# EAGLE board Battery Charger (EAGLE 9.6.2)
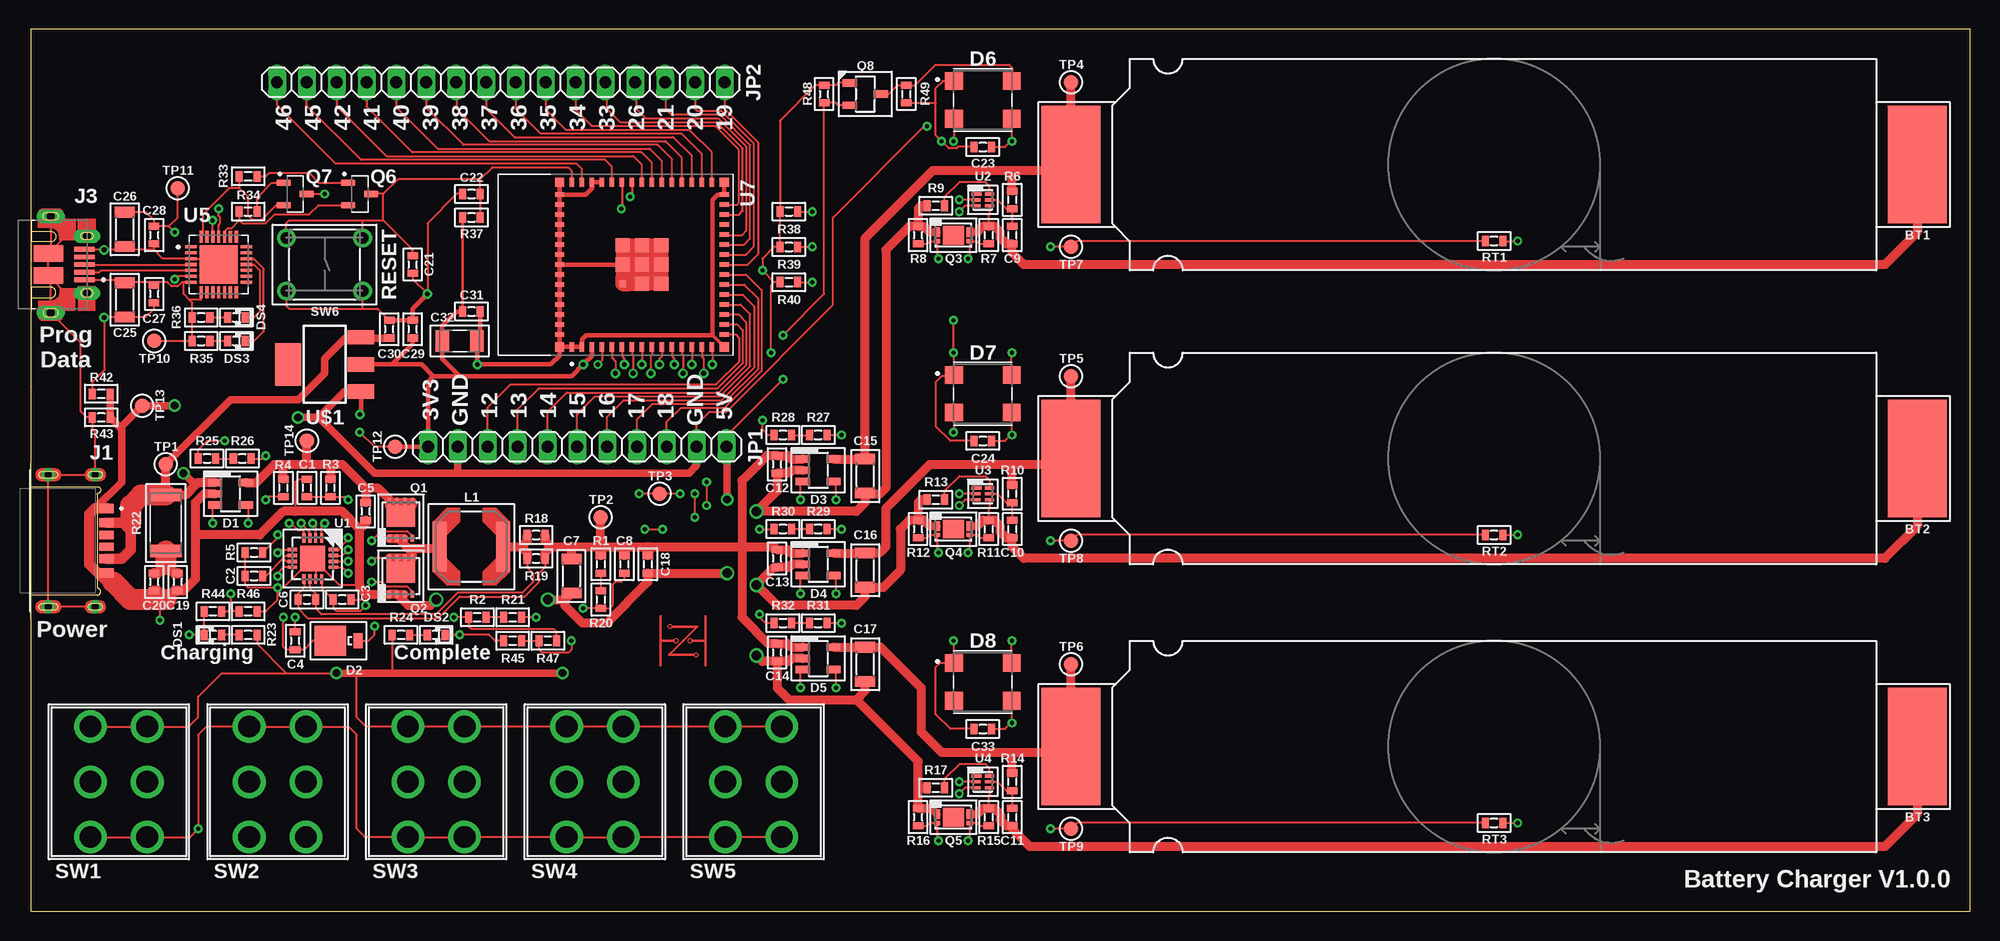
[diagram p5: board, top side]
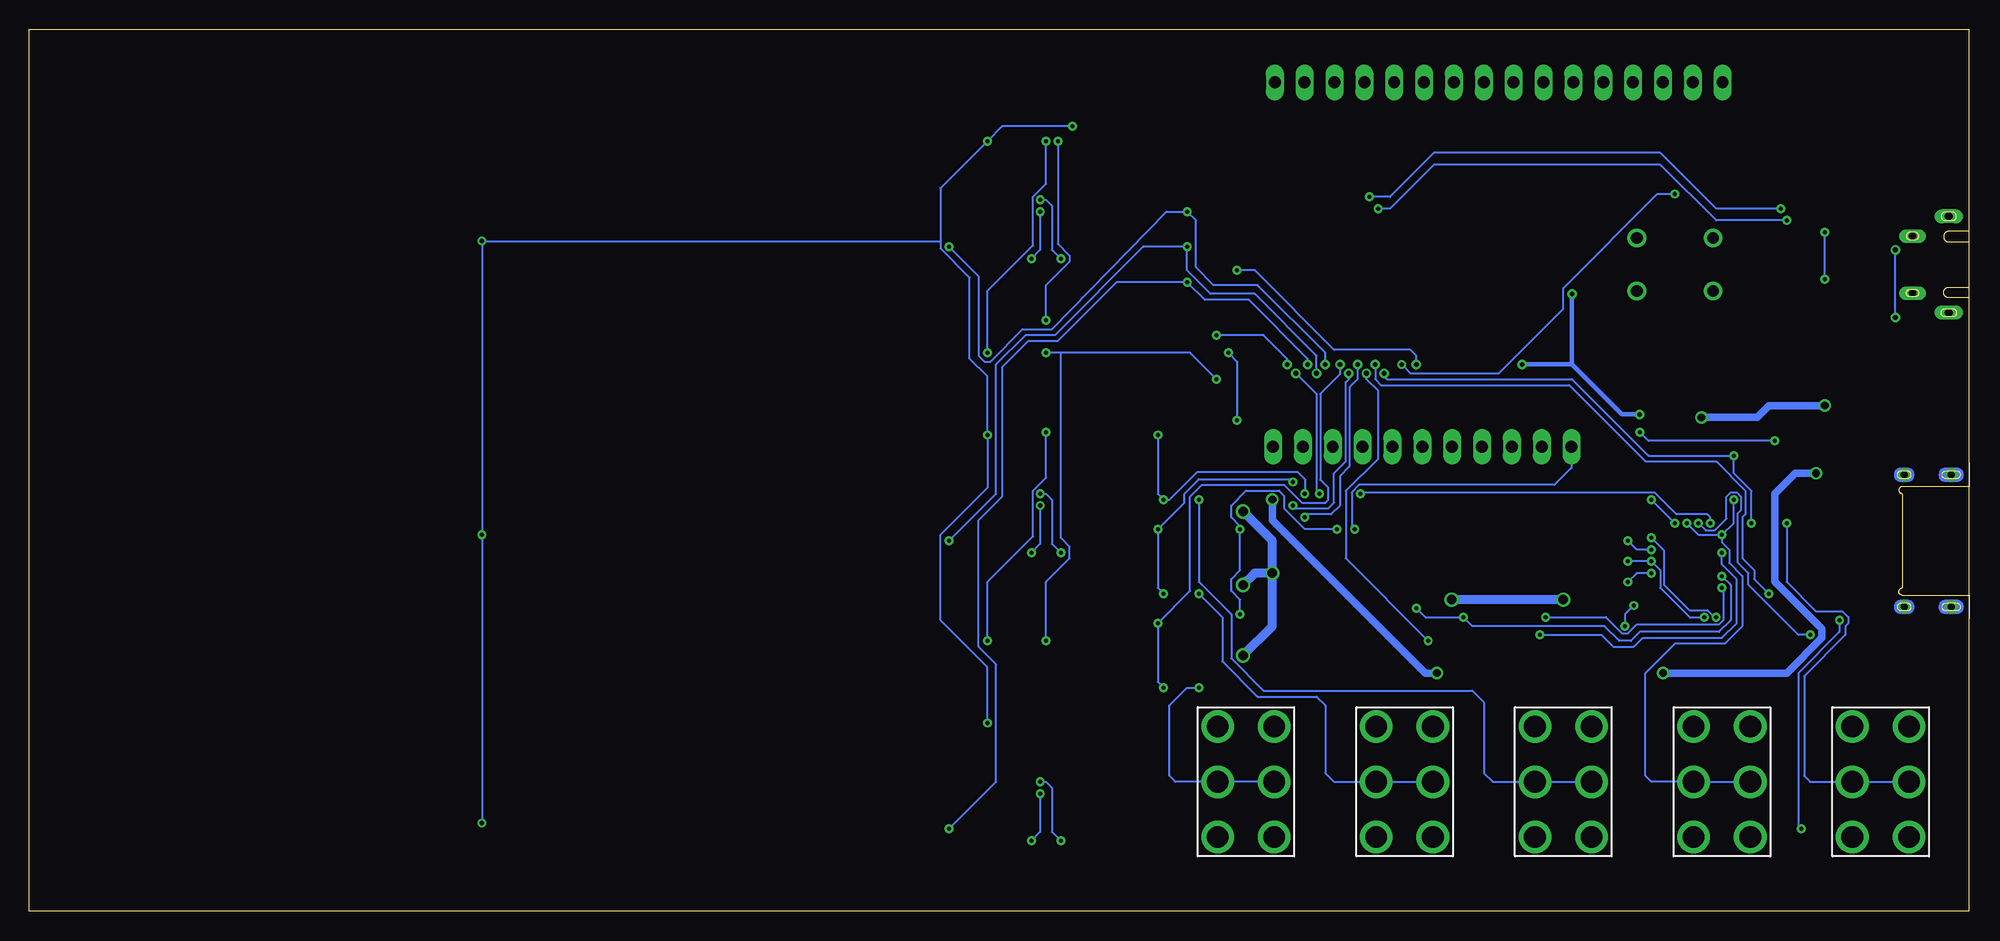
[diagram p6: board, bottom side, seen from below]

Size 165 x 75 mm. Coordinates in mm from the lower left corner, seen from the top.
Outline: 0,0 165,0 165,75 0,75 0,0
Copper layers (1*16): Top 0.035mm / dielectric 1.5mm / Bottom 0.035mm
Design rules "default": minimum track width 6mil, minimum drill 0.35mm, track to track 6mil, track to pad 6mil, pad to pad 6mil, via to via 6mil, smd to smd 6mil, copper to edge 40mil, drill to drill 6mil, minimum pad ring 10mil, minimum via ring 8mil, stop-mask expansion 4mil, vias tented up to drill 0mil, thermal gap 10mil

## Footprints (pad centres in the part's own frame; a part is rotated, then mirrored left to right if it is on the bottom)
18650-SOLDERED = smd 5 x 10: A -36,0; C 36,0
1608 = smd 0.6 x 0.9: 1 -0.75,0; 2 0.75,0
3216 = smd 0.9 x 1.7: 1 -1.45,0; 2 1.45,0
CAPC3216X110N = smd 1.16 x 1.82: 1 -1.475,0; 2 1.475,0
SOT23-5 = smd 1.22 x 0.62: 1 -1.31,0.95; 2 -1.31,0; 3 -1.31,-0.95; 4 1.31,-0.95; 5 1.31,0.95
POWERMITE = smd 0.76 x 1.27: A 2.349,0 | smd 2.67 x 2.54: C 0,0
LED_SK6812 = smd 1.5 x 1.5: 1 -2.45,1.6; 2 -2.45,-1.6; 3 2.45,-1.6; 4 2.45,1.6
1608-POL = smd 0.6 x 0.9: A 0.75,0; C -0.75,0
GCT_USB4515-GF-A_REVA = smd 0.7 x 1.2: A5 -0.5,4.95; B5 0.5,4.95 | smd 0.76 x 1.2: A9 1.52,4.95; B9 -1.52,4.95 | smd 0.8 x 1.2: A12 2.75,4.95; B12 -2.75,4.95 | drill 0.6 pad 1.1: S1 -5.62,0; S2 5.62,0; S3 -5.62,4; S4 5.62,4
AMPHENOL_10103592-0001LF = smd 0.4 x 1.75: 1 1.3,2.875; 2 0.65,2.875; 3 0,2.875; 4 -0.65,2.875; 5 -1.3,2.875 | drill 0.7 pad 0.9 long: S1 -4.1,0; S3 4.1,0 | drill 0.65 pad 0.73 long: S2 -2.425,3.08; S4 2.425,3.08 | smd 1.375 x 2.5: S5 -0.938,-0.2; S6 0.938,-0.2
1X11 = drill 1.016 long: 1 -12.7,0; 2 -10.16,0; 3 -7.62,0; 4 -5.08,0; 5 -2.54,0; 6 0,0; 7 2.54,0; 8 5.08,0; 9 7.62,0; 10 10.16,0; 11 12.7,0
1X16 = drill 1.016 long: 1 -19.05,0; 2 -16.51,0; 3 -13.97,0; 4 -11.43,0; 5 -8.89,0; 6 -6.35,0; 7 -3.81,0; 8 -1.27,0; 9 1.27,0; 10 3.81,0; 11 6.35,0; 12 8.89,0; 13 11.43,0; 14 13.97,0; 15 16.51,0; 16 19.05,0
6060 = smd 1.2 x 4.25: 1 -2.7,0; 2 2.7,0
SON-3333 = smd 0.6 x 0.3: 1 -1.55,0.975; 2 -1.55,0.325; 3 -1.55,-0.325; 4 -1.55,-0.975; 5 1.55,-0.975; 6 1.55,-0.325; 7 1.55,0.325; 8 1.55,0.975 | smd 1.775 x 2.45: PAD 0.325,0
UDFN-6-B = smd 0.53 x 0.84: 1 -1.385,0.255; 6 1.385,0.255 | smd 0.53 x 0.35: 3 -1.385,-0.5; 4 1.385,-0.5 | smd 1.8 x 1.6: PAD 0,0
SOT95P230X110-3N = smd 1.26 x 0.59: 1 -0.98,0.95; 2 -0.98,-0.95; 3 0.98,0
SOT23-3 = smd 1.22 x 0.62: 1 -1.31,0.95; 2 -1.31,-0.95; 3 1.31,0
RESC5025X65N = smd 1.07 x 2.67: 1 -2.38,0; 2 2.38,0
100DP1T1B1M2QE = drill 1.85: 1-A -2.41,4.7; 1-B 2.41,4.7; 2-A -2.41,-4.7; 2-B 2.41,-4.7; COM-A -2.41,0; COM-B 2.41,0
THT-6060 = drill 1 pad 1.6: 1 3.25,-2.25; 2 -3.25,-2.25; 3 3.25,2.25; 4 -3.25,2.25
SMD-C-1.25 = smd 1.25 x 1.25: 1 0,0
QFN-16-3535 = smd 0.8 x 0.28: 1 -1.75,0.75; 2 -1.75,0.25; 3 -1.75,-0.25; 4 -1.75,-0.75; 9 1.75,-0.75; 10 1.75,-0.25; 11 1.75,0.25; 12 1.75,0.75 | smd 0.28 x 0.8: 5 -0.75,-1.75; 6 -0.25,-1.75; 7 0.25,-1.75; 8 0.75,-1.75; 13 0.75,1.75; 14 0.25,1.75; 15 -0.25,1.75; 16 -0.75,1.75 | smd 2.14 x 2.14: PAD 0,0
WSON-6 = smd 0.85 x 0.28: 1 -0.525,0.5 | smd 0.75 x 0.28: 2 -0.575,0; 3 -0.575,-0.5; 4 0.575,-0.5; 5 0.575,0; 6 0.575,0.5
QFN50P500X500X80-29N = smd 0.99 x 0.27: 1 -2.36,1.5; 2 -2.36,1; 3 -2.36,0.5; 4 -2.36,0; 5 -2.36,-0.5; 6 -2.36,-1; 7 -2.36,-1.5; 15 2.36,-1.5; 16 2.36,-1; 17 2.36,-0.5; 18 2.36,0; 19 2.36,0.5; 20 2.36,1; 21 2.36,1.5 | smd 0.27 x 0.99: 8 -1.5,-2.36; 9 -1,-2.36; 10 -0.5,-2.36; 11 0,-2.36; 12 0.5,-2.36; 13 1,-2.36; 14 1.5,-2.36; 22 1.5,2.36; 23 1,2.36; 24 0.5,2.36; 25 0,2.36; 26 -0.5,2.36; 27 -1,2.36; 28 -1.5,2.36 | smd 3.25 x 3.25: 29 0,0
XCVR_ESP32-S2-MINI-1 = smd 0.8 x 0.4: 1 -7,5.95; 2 -7,5.1; 3 -7,4.25; 4 -7,3.4; 5 -7,2.55; 6 -7,1.7; 7 -7,0.85; 8 -7,0; 9 -7,-0.85; 10 -7,-1.7; 11 -7,-2.55; 12 -7,-3.4; 13 -7,-4.25; 14 -7,-5.1; 15 -7,-5.95; 31 7,-5.95; 32 7,-5.1; 33 7,-4.25; 34 7,-3.4; 35 7,-2.55; 36 7,-1.7; 37 7,-0.85; 38 7,0; 39 7,0.85; 40 7,1.7; 41 7,2.55; 42 7,3.4; 43 7,4.25; 44 7,5.1; 45 7,5.95 | smd 0.4 x 0.8: 16 -5.95,-7; 17 -5.1,-7; 18 -4.25,-7; 19 -3.4,-7; 20 -2.55,-7; 21 -1.7,-7; 22 -0.85,-7; 23 0,-7; 24 0.85,-7; 25 1.7,-7; 26 2.55,-7; 27 3.4,-7; 28 4.25,-7; 29 5.1,-7; 30 5.95,-7; 46 5.95,7; 47 5.1,7; 48 4.25,7; 49 3.4,7; 50 2.55,7; 51 1.7,7; 52 0.85,7; 53 0,7; 54 -0.85,7; 55 -1.7,7; 56 -2.55,7; 57 -3.4,7; 58 -4.25,7; 59 -5.1,7; 60 -5.95,7 | smd 1.2 x 1.2: 61 0,0; 61_1 -1.65,0; 61_2 -1.65,-1.65; 61_3 0,-1.65; 61_4 1.65,-1.65; 61_5 1.65,0; 61_6 1.65,1.65; 61_7 0,1.65 | smd 0.6 x 0.6: 61_8 -1.65,1.65 | smd 0.8 x 0.8: 62 -7,7; 63 -7,-7; 64 7,-7; 65 7,7
SOT223 = smd 1.219 x 2.235: 1 -2.311,-3.099; 2 0,-3.099; 3 2.311,-3.099 | smd 3.6 x 2.2: TAB 0,3.099

## Placement (x,y rotation side)
BT1  Li-Ion  [18650-SOLDERED]  124.5,63.5 180 top
BT2  Li-Ion  [18650-SOLDERED]  124.5,38.5 180 top
BT3  Li-Ion  [18650-SOLDERED]  124.5,14 180 top
C1  1µF 10%  [1608]  23.5,36 90 top
C2  1µF 10%  [1608]  19,28.5 180 top
C3  1µF 10%  [1608]  26.5,26.5 0 top
C4  100nF 10%  [1608]  22.5,23 90 top
C5  10µF 10%  [1608]  28.5,34 270 top
C6  100nF 10%  [1608]  23.5,26.5 180 top
C7  4.7µF 10%  [3216]  46,28.5 270 top
C8  22pF 5%  [1608]  50.5,29.5 270 top
C9  100nF 10%  [1608]  83.5,57.5 270 top
C10  100nF 10%  [1608]  83.5,32.5 270 top
C11  100nF 10%  [1608]  83.5,8 270 top
C12  1µF 10%  [1608]  63.5,38 270 top
C13  1µF 10%  [1608]  63.5,30 270 top
C14  1µF 10%  [1608]  63.5,22 270 top
C15  4.7µF 10%  [3216]  71,37 270 top
C16  4.7µF 10%  [3216]  71,29 270 top
C17  4.7µF 10%  [3216]  71,21 270 top
C18  10µF 10%  [1608]  52.5,29.5 270 top
C19  1µF 10%  [1608]  12.5,28 270 top
C20  1µF 10%  [1608]  10.5,28 270 top
C21  100nF 10%  [1608]  32.5,55 90 top
C22  100nF 10%  [1608]  37.5,61 180 top
C23  100nF 10%  [1608]  81,65 0 top
C24  100nF 10%  [1608]  81,40 0 top
C25  4.7µF 10%  [3216]  8,52 270 top
C26  4.7µF 10%  [3216]  8,58 270 top
C27  100nF 10%  [1608]  10.5,52.5 270 top
C28  100nF 10%  [1608]  10.5,57.5 270 top
C29  10µF 10%  [1608]  32.5,49.5 90 top
C30  100nF 10%  [1608]  30.5,49.5 90 top
C31  100nF 10%  [1608]  37.5,51 0 top
C32  C1206C226K8RACTU  [CAPC3216X110N]  36.5,48.5 180 top
C33  100nF 10%  [1608]  81,15.5 0 top
D1  LTC4411  [SOT23-5]  17,35.5 0 top
D2  MBRM120LT  [POWERMITE]  25.5,23 0 top
D3  LTC4411  [SOT23-5]  67,37.5 0 top
D4  LTC4411  [SOT23-5]  67,29.5 0 top
D5  LTC4411  [SOT23-5]  67,21.5 0 top
D6  SK6812  [LED_SK6812]  81,69 0 top
D7  SK6812  [LED_SK6812]  81,44 0 top
D8  SK6812  [LED_SK6812]  81,19.5 0 top
DS1  Blue  [1608-POL]  15.5,23.5 0 top
DS2  Green  [1608-POL]  34.5,23.5 180 top
DS3  Green  [1608-POL]  17.5,48.5 180 top
DS4  Green  [1608-POL]  17.5,50.5 180 top
J1  USB4515-GF-A_REVA  [GCT_USB4515-GF-A_REVA]  1.5,31.5 270 top
J3  10103592-0001LF  [AMPHENOL_10103592-0001LF]  1.7,55 270 top
JP1  [1X11]  46.5,39.5 180 top
JP2  [1X16]  40,70.5 180 top
L1  10µH 20%  [6060]  37.5,31 0 top
LOGO1  SIGNATUREZACHARY  [SIGN-ZACHARY]  55.5,23 0 top
Q1  CSD16406Q3  [SON-3333]  31.5,33.25 90 top
Q2  CSD16406Q3  [SON-3333]  31.5,28.5 90 top
Q3  DMN2008LFU  [UDFN-6-B]  78.5,57.5 0 top
Q4  DMN2008LFU  [UDFN-6-B]  78.5,32.5 0 top
Q5  DMN2008LFU  [UDFN-6-B]  78.5,8 0 top
Q6  BC817  [SOT95P230X110-3N]  28,61 0 top
Q7  BC817  [SOT95P230X110-3N]  22.5,61 0 top
Q8  DMN53D0L  [SOT23-3]  71,69.5 0 top
R1  10kΩ 0.1%  [1608]  48.5,29.5 90 top
R2  10kΩ 0.1%  [1608]  38,25 0 top
R3  10Ω 5%  [1608]  25.5,36 90 top
R4  47kΩ 0.1%  [1608]  21.5,36 90 top
R5  20kΩ 0.5%  [1608]  19,30.5 0 top
R6  330Ω 1%  [1608]  83.5,60.5 90 top
R7  4.75MΩ 1%  [1608]  81.5,57.5 270 top
R8  4.75MΩ 1%  [1608]  75.5,57.5 270 top
R9  2.2kΩ 1%  [1608]  77,60 0 top
R10  330Ω 1%  [1608]  83.5,35.5 90 top
R11  4.75MΩ 1%  [1608]  81.5,32.5 270 top
R12  4.75MΩ 1%  [1608]  75.5,32.5 270 top
R13  2.2kΩ 1%  [1608]  77,35 0 top
R14  330Ω 1%  [1608]  83.5,11 90 top
R15  4.75MΩ 1%  [1608]  81.5,8 270 top
R16  4.75MΩ 1%  [1608]  75.5,8 270 top
R17  2.2kΩ 1%  [1608]  77,10.5 0 top
R18  50mΩ 1%  [1608]  43,32 0 top
R19  50mΩ 1%  [1608]  43,30 0 top
R20  0Ω <20mΩ  [1608]  48.5,26.5 90 top
R21  0Ω <20mΩ  [1608]  41,25 0 top
R22  CRGH2010J2R0  [RESC5025X65N]  11.5,33 90 top
R23  10kΩ 0.1%  [1608]  18.5,23.5 0 top
R24  10kΩ 0.1%  [1608]  31.5,23.5 180 top
R25  442kΩ 1%  [1608]  15,38.5 180 top
R26  33kΩ 1%  [1608]  18,38.5 180 top
R27  33kΩ 1%  [1608]  67,40.5 180 top
R28  442kΩ 1%  [1608]  64,40.5 180 top
R29  33kΩ 1%  [1608]  67,32.5 180 top
R30  442kΩ 1%  [1608]  64,32.5 180 top
R31  33kΩ 1%  [1608]  67,24.5 180 top
R32  442kΩ 1%  [1608]  64,24.5 180 top
R33  10kΩ 0.1%  [1608]  18.5,62.5 0 top
R34  10kΩ 0.1%  [1608]  18.5,59.5 0 top
R35  10kΩ 0.1%  [1608]  14.5,48.5 180 top
R36  10kΩ 0.1%  [1608]  14.5,50.5 180 top
R37  10kΩ 0.1%  [1608]  37.5,59 180 top
R38  10kΩ 0.1%  [1608]  64.5,59.5 180 top
R39  10kΩ 0.1%  [1608]  64.5,56.5 180 top
R40  10kΩ 0.1%  [1608]  64.5,53.5 180 top
R42  0Ω <20mΩ  [1608]  6,44 0 top
R43  0Ω <20mΩ  [1608]  6,42 0 top
R44  75kΩ 0.1%  [1608]  15.5,25.5 180 top
R45  75kΩ 0.1%  [1608]  41,23 180 top
R46  100kΩ 0.1%  [1608]  18.5,25.5 180 top
R47  100kΩ 0.1%  [1608]  44,23 180 top
R48  10kΩ 0.1%  [1608]  67.5,69.5 90 top
R49  10kΩ 0.1%  [1608]  74.5,69.5 270 top
RT1  10kΩ 5%  [1608]  124.5,57 180 top
RT2  10kΩ 5%  [1608]  124.5,32 180 top
RT3  10kΩ 5%  [1608]  124.5,7.5 180 top
SW1  [100DP1T1B1M2QE]  7.5,11 0 top
SW2  [100DP1T1B1M2QE]  21,11 0 top
SW3  [100DP1T1B1M2QE]  34.5,11 0 top
SW4  [100DP1T1B1M2QE]  48,11 0 top
SW5  [100DP1T1B1M2QE]  61.5,11 0 top
SW6  [Override]  [THT-6060]  25,55 0 top
TP1-5.0V  TEST_POINT-SMD-C-1.25  [SMD-C-1.25]  11.5,38 0 top
TP2-CHARGER  TEST_POINT-SMD-C-1.25  [SMD-C-1.25]  48.5,33.5 0 top
TP3-TS  TEST_POINT-SMD-C-1.25  [SMD-C-1.25]  53.5,35.5 0 top
TP4-BATT_A  TEST_POINT-SMD-C-1.25  [SMD-C-1.25]  88.5,70.5 0 top
TP5-BATT_B  TEST_POINT-SMD-C-1.25  [SMD-C-1.25]  88.5,45.5 0 top
TP6-BATT_C  TEST_POINT-SMD-C-1.25  [SMD-C-1.25]  88.5,21 0 top
TP7-TEMP_A  TEST_POINT-SMD-C-1.25  [SMD-C-1.25]  88.5,56.5 180 top
TP8-TEMP_B  TEST_POINT-SMD-C-1.25  [SMD-C-1.25]  88.5,31.5 180 top
TP9-TEMP_C  TEST_POINT-SMD-C-1.25  [SMD-C-1.25]  88.5,7 180 top
TP10-USB_5.0V  TEST_POINT-SMD-C-1.25  [SMD-C-1.25]  10.5,48.5 180 top
TP11-CP2102N_VDD  TEST_POINT-SMD-C-1.25  [SMD-C-1.25]  12.5,61.5 0 top
TP12-3.3V  TEST_POINT-SMD-C-1.25  [SMD-C-1.25]  31,39.5 90 top
TP13-GND  TEST_POINT-SMD-C-1.25  [SMD-C-1.25]  9.5,43 180 top
TP14-D1_OUT  TEST_POINT-SMD-C-1.25  [SMD-C-1.25]  23.5,40 0 top
U1  BQ24650  [QFN-16-3535]  24,30 270 top
U2  BQ29700  [WSON-6]  81,60.5 0 top
U3  BQ29700  [WSON-6]  81,35.5 0 top
U4  BQ29700  [WSON-6]  81,11 0 top
U5  CP2102N-A02-GQFN28  [QFN50P500X500X80-29N]  16,55 0 top
U7  ESP32-S2-MINI-1  [XCVR_ESP32-S2-MINI-1]  52,55 90 top
U$1  LD1117AS33  [SOT223]  25,46.5 90 top

## Tracks (layer width: path | path; a pad name or v marks a point on that pad's centre or on a via)
3.3V  (via drill 0.35, 0.4)
  Top 0.17: R40.2 63.25,53.5 | 63.25,53.5 v62.25,54.5 62.25,55.5 63.25,56.5 R39.2 R38.2 63.75,67.25 66.75,70.25 R48.2 68.5,70.25 68.7,70.45 Q8.1 | v63,47.5 63,53.25 63.25,53.5 | R28.2 62.75,40.5 62.25,41 v62.25,41.75 | v52.25,32.5 v53.75,32.5 | v62,32.5 R30.2 | R32.2 62.5,24.5 62,25 v62,25.25 | TP12-3.3V.1 29.25,39.5 v28,40.75 | R25.2 14.25,39.25 15,40 v16.5,40
  Top 0.193: C31.1 R37.2
  Top 0.391: 36.5,45.5 46,45.5 v47,46.5 47.75,47.25 U7.3 | TP12-3.3V.1 JP1.11 33.8,45.05 34.25,45.5 | C29.1 32.5,48.25 30.75,46.5 | U$1.2 30.75,46.5 | 36.5,45.5 35.02,46.98 C32.2 35.02,49.77 36.25,51 C31.1 | 30.75,46.5 33.25,46.5 34.25,45.5 | 34.25,45.5 36.5,45.5
  Bottom 0.17: v47,46.5 47,47.25 47.5,47.75 54,47.75 60.75,54.5 v62.25,54.5 | v63,47.5 62.25,46.75 v62.25,41.75 | JP1.11 33.8,37.7 35.25,36.25 51.87,36.25 52.5,35.62 52.5,32.75 v52.25,32.5 | v53.75,32.5 56.5,32.5 58.25,34.25 58.25,35.33 58.68,35.77 61.48,35.77 62.75,34.5 62.75,33.5 62,32.75 v62,32.5 62,29 62.75,28.25 62.75,27.25 62,26.5 v62,25.25 | v16.5,40 27.25,40 v28,40.75
5.0V  (via drill 0.35, 0.65)
  Top 0.17: SW1.1-A SW1.1-B 13.45,15.7 14.25,16.5 14.25,18.25 16.25,20.25 21.75,20.25 | SW5.1-B SW5.1-A SW4.1-B SW4.1-A SW3.1-B SW3.1-A 28.55,15.7 27.75,16.5 27.75,20 28,20.25 | R23.2 19.25,22.75 21.75,20.25 | 21.75,20.25 v26,20.25 | 30.5,20.25 30.75,20.5 R24.2 | C24.1 78.25,40 77,41.25 77,45 77.5,45.5 78.45,45.5 D7.1 78.55,47.45 v78.5,47.5 v78.5,50.25 | D6.1 77.6,70.6 77,70 77,68.75 | C33.1 78.25,15.5 77,16.75 77,20.75 77.35,21.1 D8.1 78.55,22.95 v78.5,23 | C23.1 78.87,65 78.75,64.88 78.12,64.88 v77.5,65.5 77,66 77,68.75 | JP1.1 59.2,40.45 v64,45.25 | R49.2 77,68.75
  Top 0.621: C30.1 28.16,48.75 U$1.3 28.04,48.75 26.75,48.75 25,47 25,45.75 22.75,43.5 17,43.5 TP1-5.0V.1 | v13,37.25 14,36.25 | v26,20.25 28,20.25 30.5,20.25 v45.25,20.25 | v59.25,35 59.25,39.45 JP1.1
  Top 0.78: D1.1 14.2,36.45 14,36.25 13.13,35.38 R22.2 TP1-5.0V.1
  Top 0.89: J1.A9 7.73,29.98 8.5,30.75 8.5,33 8.48,33.02 J1.B9
  Top 1.78: R22.2 9.38,35.38 8.5,34.5 8.5,33
  Bottom 0.17: v64,45.25 66.25,47.5 77.25,47.5 | 77.25,47.5 v78.5,47.5 | v78.5,50.25 78.5,53.25 76.5,55.25 76.5,55.75 77.5,56.75 v77.5,65.5 | v78.5,23 78.5,28 76.5,30 76.5,31 77.25,31.75 77.25,47.5
  Bottom 0.621: v13,37.25 14.75,37.25 16.5,35.5 16.5,28 12.5,24 12.5,23.25 15.5,20.25 v26,20.25 | v45.25,20.25 46.25,20.25 59.25,33.25 v59.25,35
BQ24650_BTST  (via drill 0.35)
  Top 0.17: D2.C 24,23 23.25,22.25 C4.1 21.75,22.25 21.5,22.5 v21.5,25 | U1.16 26.25,30.75 26.38,30.88 26.38,31 27,31.62 v27,31.75
  Bottom 0.17: v27,31.75 25.93,30.68 25.93,27.75 23.79,25.62 22.25,25.62 21.63,25 v21.5,25
BQ24650_HIGHDV  (via drill 0.35)
  Top 0.17: Q1.4 32.41,31.77 32.41,31.96 32.04,32.33 29.83,32.33 v29,31.5 | U1.15 26.5,30.25 v27,30.75
  Bottom 0.17: v27,30.75 28.25,30.75 v29,31.5
BQ24650_LODRV  (via drill 0.35)
  Top 0.17: v29,28 29.88,28 30.3,27.58 32.09,27.58 32.45,27.21 32.45,26.97 Q2.4 | U1.13 26.5,29.25 v27,28.75
  Bottom 0.17: v27,28.75 28.25,28.75 v29,28
BQ24650_PH  (via drill 0.35)
  Top 0.17: U1.14 v27,29.75 | v29,29.75 29.3,30.05 Q2.8 | C4.2 v22.5,25
  Top 0.69: Q1.3 Q1.2
  Top 0.78: L1.1 34.66,30.86 32.1,30.86 | Q2.8 Q2.7 | Q2.7 Q2.6 Q2.5 32.48,30.48 32.1,30.86 | Q2.PAD 31.18,29.15 Q2.7 | Q1.1 Q1.2 31.26,31.7 32.1,30.86
  Bottom 0.17: v29,29.75 v27,29.75 26.25,29 26.25,27.5 23.75,25 v22.5,25
BQ24650_REGN  (via drill 0.35)
  Top 0.17: D2.A 28.75,23 29.25,23.5 v29.25,24.25 | v28.5,26 28.07,25.57 25.93,25.57 25.75,25.75 C3.1 24.75,27.5 U1.12
  Bottom 0.17: v28.5,26 29.25,25.25 v29.25,24.25
BQ24650_SR_P
  Top 0.17: U1.10 23.75,27.5 24.25,27 C6.1 24.25,25.75 24.75,25.25 34.5,25.25 36.32,27.07 41.82,27.07 42.75,28 42.75,28.75 42.25,29.25 R19.1
  Top 0.78: L1.2 41.75,31 | R18.1 42.25,31.5 41.75,31 | 41.75,31 42.25,30.5 R19.1
BQ24650_STAT1  (via drill 0.35)
  Top 0.17: U1.3 23.75,32.25 v23,33 | R44.2 DS1.C v13.5,23.5
  Bottom 0.17: v23,33 22.38,32.38 21.62,32.38 20.62,33.38 20.62,35.26 20.25,35.62 19.75,35.62 19.38,35.26 19.38,34.12 19.68,33.82 19.68,29.68 18.75,28.75 18.75,27.75 14.5,23.5 v13.5,23.5
BQ24650_STAT2  (via drill 0.35)
  Top 0.17: v21,30.5 21.25,30.75 U1.5 | DS2.C v36.5,23.5 39,23.5 39.5,23 R45.2
  Bottom 0.17: v36.5,23.5 31.25,23.5 30.25,22.5 28.5,22.5 27.75,23.25 21,23.25 19.75,24.5 19.75,28.25 21,29.5 v21,30.5
BQ24650_VCC  (via drill 0.35)
  Top 0.17: C1.1 R3.1 26.75,35.25 v27,35 | U1.1 24.75,32.75 v25,33
  Bottom 0.17: v25,33 v27,35
BQ24650_VFB  (via drill 0.35)
  Top 0.17: v47,25.75 R20.1 49.25,25.75 49.5,26 49.5,27.75 49.75,28 50.25,28 50.5,28.25 C8.2 | U1.8 21.5,29.25 21,28.75 v21,28.5 | v43,25 R21.2
  Bottom 0.17: v47,25.75 46.25,25 v43,25 42.25,24.25 31,24.25 29.75,23 28.75,23 28,23.75 21.25,23.75 20.25,24.75 20.25,27.75 v21,28.5
BQ24650_VREF
  Top 0.17: U1.6 21.75,30.25 21.5,30 | 21.5,30 21.75,29.75 U1.7 | 21.5,30 20,28.5 C2.1
BQ297001_BAT
  Top 0.17: U2.5 82.25,60.5 83,59.75 R6.1 C9.1
BQ297001_COUT  (via drill 0.35)
  Top 0.17: U2.2 v79,60.5 | v77.25,55.5 77.11,55.63 Q3.3 76.5,57 76.25,56.75 R8.2
  Bottom 0.17: v79,60.5 78.5,60.5 78,60 78,56.25 v77.25,55.5
BQ297001_DOUT  (via drill 0.35)
  Top 0.17: v79,59.5 79.5,60 U2.3 | v79.75,55.5 79.89,55.63 Q3.4 80.5,57 80.75,56.75 R7.2
  Bottom 0.17: v79.75,55.5 79,56.25 v79,59.5
BQ297001_V-
  Top 0.17: R9.2 77.75,60.75 79,62 81.25,62 81.58,61.67 U2.6
BQ297001_VSS
  Top 0.17: U2.4 81.58,59.33 81.5,59.25 R7.1
  Top 0.6: 80.5,57.76 Q3.6
  Top 0.78: BT1.A 160.5,57.75 157.75,55 84.5,55 83.5,56 C9.2 83,56.75 82.49,57.26 82.49,57.76 82,58.25 R7.1 80.99,58.25 80.5,57.76
BQ297002_BAT
  Top 0.17: U3.5 82.25,35.5 83,34.75 R10.1 C10.1
BQ297002_COUT  (via drill 0.35)
  Top 0.17: U3.2 v79,35.5 | v77.25,30.5 77.11,30.64 Q4.3 76.5,32 76.25,31.75 R12.2
  Bottom 0.17: v79,35.5 78.5,35.5 78,35 78,31.25 v77.25,30.5
BQ297002_DOUT  (via drill 0.35)
  Top 0.17: v79,34.5 79.5,35 U3.3 | v79.75,30.5 79.89,30.64 Q4.4 80.5,32 80.75,31.75 R11.2
  Bottom 0.17: v79.75,30.5 79,31.25 v79,34.5
BQ297002_V-
  Top 0.17: U3.6 81.58,36.67 81.25,37 79,37 77.75,35.75 R13.2
BQ297002_VSS
  Top 0.17: U3.4 81.58,34.33 81.5,34.25 R11.1
  Top 0.6: 80.5,32.75 Q4.6
  Top 0.78: BT2.A 160.5,32.75 157.75,30 84.5,30 83.5,31 C10.2 83,31.75 82.5,32.25 82.5,32.75 82,33.25 R11.1 81,33.25 80.5,32.75
BQ297003_BAT
  Top 0.17: U4.5 82.25,11 83,10.25 R14.1 C11.1
BQ297003_COUT  (via drill 0.35)
  Top 0.17: U4.2 v79,11 | v77.25,6 77.11,6.13 Q5.3 76.5,7.5 76.25,7.25 R16.2
  Bottom 0.17: v79,11 78.5,11 78,10.5 78,6.75 v77.25,6
BQ297003_DOUT  (via drill 0.35)
  Top 0.17: v79,10 79.5,10.5 U4.3 | v79.75,6 79.89,6.13 Q5.4 80.5,7.5 80.75,7.25 R15.2
  Bottom 0.17: v79,10 79,6.75 v79.75,6
BQ297003_V-
  Top 0.17: R17.2 77.75,11.25 79,12.5 81.25,12.5 81.58,12.18 U4.6
BQ297003_VSS
  Top 0.17: U4.4 81.58,9.82 81.5,9.75 R15.1
  Top 0.65: Q5.6 80.5,8.26
  Top 0.78: BT3.A 160.5,8.25 157.75,5.5 85,5.5 83.5,7 C11.2 83,7.25 82.5,7.75 82.5,8.25 82,8.75 R15.1 81,8.75 80.5,8.25 80.5,8.26
CHARGER
  Top 0.17: U1.9 23.25,27.5 22.75,27 C6.2 22.75,25.75 23.57,24.93 34.68,24.93 36.5,26.75 42,26.75 43.25,28 43.25,28.75 43.75,29.25 R19.2
  Top 0.78: R18.2 43.75,31.5 44.25,31 | R19.2 43.75,30.5 44.25,31 | 44.25,31 46,31 | 46,31 48.5,31 | 48.5,31 50.5,31 | 50.5,31 52.5,31 | C7.1 46,31 | R1.2 48.5,31 | C8.1 50.5,31 | C18.1 52.5,31 | 48.5,31 TP2-CHARGER.1 | 52.5,31 60.5,31 | 60.5,31 63.25,31 C13.1 64.39,30.75 64.69,30.45 D4.1 | D3.1 64.69,38.45 64.39,38.75 C12.1 62.63,38.75 60.5,36.62 60.5,31 | D5.1 64.69,22.45 64.39,22.75 C14.1 62.75,22.75 60.5,25 60.5,31
CHASSIS
  Top 0.17: J3.S1 1.7,56.14 J3.S5 | 1.7,53.86 J3.S3 4.25,48.35 4.25,42.5 4.75,42 R43.1 5.25,41 5.5,40.75 J1.S3 J1.S1 J1.S2 J1.S4 | 1.7,53.86 J3.S6 J3.S5 | J3.S4 2.99,52.58 1.7,53.86 | J3.S2 2.99,57.42 J3.S5
CP2102N_DTR
  Top 0.17: U5.28 14.63,57.49 14.63,59.25 16.88,61.5 17.75,61.5 | 17.75,61.5 18.46,60.79 18.46,59.2 18.85,58.81 19.65,58.81 20.89,60.05 Q7.2 | R33.1 17.75,61.5
CP2102N_RTS
  Top 0.17: R34.1 17.75,58.75 | Q6.2 24.49,60.05 23.7,59.27 20.77,59.27 19.99,58.49 18.01,58.49 17.75,58.75 | 17.75,58.75 17.09,58.09 16.77,58.09 16.5,57.83 U5.24
CP2102N_RXT
  Top 0.17: U5.18 19,55 19.5,54.5 19.5,51 19,50.5 DS4.C
CP2102N_TXT
  Top 0.17: U5.19 18.96,55.5 19.82,54.63 19.82,49.32 19,48.5 DS3.C
CP2102N_VDD  (via drill 0.35)
  Top 0.17: v12.25,53.75 12.5,54 U5.6 | v12.25,57.75 11.75,58.25 | 11.75,58.25 C28.1 10.5,58.75 9.8,59.45 C26.1 | 11.75,58.25 12.5,59 TP11-CP2102N_VDD.1
  Bottom 0.17: v12.25,53.75 v12.25,57.75
D1_OUT
  Top 0.78: D1.5 19.2,36.45 20.75,38 21.75,38 | 28.5,36 26.5,38 25.5,38 | 28.5,36 29.5,36 30.52,34.98 Q1.8 | 21.75,38 23.5,38 | 23.5,38 25.5,38 | Q1.8 30.52,34.55 Q1.PAD 32.48,34.55 Q1.5 Q1.6 Q1.7 Q1.8 | 28.5,36 C5.1 | 25.5,38 R3.2 | R4.2 21.5,37.75 21.75,38 | 23.5,38 TP14-D1_OUT.1
D3_OUT
  Top 0.78: D3.5 C15.1 71,57.25 76.75,63 83.5,63 | 83.5,63 88,63 BT1.C TP4-BATT_A.1 | R6.2 83.5,63
D4_OUT
  Top 0.78: D4.5 C16.1 71.05,30.5 72.25,30.5 72.75,31 72.75,34.25 76.5,38 83.75,38 | TP5-BATT_B.1 BT2.C 88,38 83.75,38 | R10.2 83.5,37.75 83.75,38
D5_OUT
  Top 0.78: D5.5 C17.1 72.3,22.45 75.75,19 75.75,15.25 77.5,13.5 83.75,13.5 | TP6-BATT_C.1 BT3.C 88,13.5 83.75,13.5 | R14.2 83.5,13.25 83.75,13.5
D+
  Top 0.17: J3.3 U5.4
D-
  Top 0.17: J3.2 5.85,54.35 6,54.5 U5.5
DGND  (via drill 0.4)
  Top 0.17: 8,56.3 10.45,56.3 | 10.45,56.3 11.25,55.5 U5.3 15.5,55.5 U5.29 | 10.45,56.3 10.5,56.35 C28.2 | C26.2 8,56.3 | J3.5 6.2,56.3 v6.25,56.25 6.3,56.3 8,56.3 | C27.2 10.5,51.25 9.8,50.55 C25.2 6.3,50.55 v6.25,50.5 6.25,46 5.25,45 R42.1
  Bottom 0.17: v6.25,50.5 v6.25,56.25
ESP32_IO12
  Top 0.17: U7.16 59.95,49.05 60.25,48.75 60.25,46.75 58.32,44.82 40.82,44.82 38.88,42.88 JP1.9
ESP32_IO13
  Top 0.17: U7.17 60.1,49.9 60.57,49.43 60.57,46.62 58.45,44.49 43.24,44.49 41.42,42.67 JP1.8
ESP32_IO14
  Top 0.17: U7.18 60.21,50.75 60.9,50.06 60.9,46.48 58.52,44.1 45.6,44.1 43.96,42.46 JP1.7
ESP32_IO15
  Top 0.17: U7.19 60.4,51.6 61.22,50.78 61.22,46.35 58.65,43.78 48.03,43.78 46.5,42.25 JP1.6
ESP32_IO16
  Top 0.17: U7.20 60.55,52.45 61.54,51.46 61.54,46.22 58.78,43.46 50.46,43.46 49.04,42.04 JP1.5
ESP32_IO17
  Top 0.17: U7.21 60.7,53.3 61.86,52.14 61.86,46.08 58.92,43.14 52.89,43.14 51.58,41.83 JP1.4
ESP32_IO18
  Top 0.17: U7.22 60.85,54.15 62.18,52.82 62.18,45.95 59.05,42.82 55.32,42.82 54.12,41.62 JP1.3
ESP32_IO19
  Top 0.17: U7.23 61,55 61.86,55.86 61.86,65.42 59.05,68.23 JP2.1
ESP32_IO20
  Top 0.17: U7.24 60.85,55.85 61.54,56.54 61.54,65.28 58.74,68.09 56.66,68.09 56.51,68.24 JP2.2
ESP32_IO21
  Top 0.17: U7.25 60.7,56.7 61.22,57.22 61.22,65.15 58.6,67.76 54.49,67.76 54,68.25 54,70.47 JP2.3
ESP32_IO26
  Top 0.17: U7.26 59.05,57.5 60.5,57.5 60.9,57.9 60.9,65.02 58.47,67.44 52.31,67.44 51.5,68.25 51.5,70.43 JP2.4
ESP32_IO33
  Top 0.17: U7.28 60.25,59.25 60.57,59.57 60.57,64.88 58.34,67.12 50.13,67.12 49,68.25 49,70.39 JP2.5
ESP32_IO34
  Top 0.17: U7.29 60.1,60.1 60.25,60.25 60.25,64.75 58.2,66.8 47.7,66.8 46.35,68.15 JP2.6
ESP32_IO35
  Top 0.17: U7.31 57.95,64.55 56.03,66.47 45.53,66.47 43.81,68.19 JP2.7
ESP32_IO36
  Top 0.17: U7.32 57.1,64.4 55.35,66.15 43.35,66.15 41.27,68.23 JP2.8
ESP32_IO37
  Top 0.17: U7.33 56.25,64.25 54.67,65.83 41.17,65.83 38.75,68.25 38.75,70.48 JP2.9
ESP32_IO38
  Top 0.17: U7.34 55.4,64.1 53.99,65.51 38.99,65.51 36.25,68.25 36.25,70.44 JP2.10
ESP32_IO39
  Top 0.17: U7.35 54.55,63.95 53.32,65.18 36.82,65.18 33.65,68.35 JP2.11
ESP32_IO40
  Top 0.17: U7.36 53.7,63.8 52.64,64.86 34.64,64.86 31.11,68.39 JP2.12
ESP32_IO41
  Top 0.17: JP2.13 28.57,68.43 32.46,64.54 51.96,64.54 52.85,63.65 U7.37
ESP32_IO42
  Top 0.17: U7.38 52,63.5 51.28,64.22 30.28,64.22 26.03,68.47 JP2.14
ESP32_IO45
  Top 0.17: U7.41 49.45,63.3 48.85,63.9 28.11,63.9 23.49,68.51 JP2.15
ESP32_IO46
  Top 0.17: U7.44 46.9,63.1 46.43,63.57 25.93,63.57 20.95,68.55 JP2.16
LED1_DIN
  Top 0.17: Q8.3 73,69.5 73.75,70.25 R49.1 75.25,70.25 77,72 83.25,72 83.5,71.75 83.5,70.65 D6.4
LED2_DIN  (via drill 0.35)
  Top 0.17: D6.2 78.55,65.5 v78.5,65.5 | D7.4 83.45,47.45 v83.5,47.5
  Bottom 0.17: v83.5,47.5 83.5,52.75 79.62,56.63 79.62,60.76 78.5,61.87 v78.5,65.5
LED3_DIN  (via drill 0.35)
  Top 0.17: D7.2 78.55,40.8 v78.5,40.75 | D8.4 83.45,22.95 v83.5,23
  Bottom 0.17: v83.5,23 83.5,28 79.62,31.88 79.62,35.76 78.5,36.87 v78.5,40.75
LEDS  (via drill 0.35, 0.4)
  Top 0.17: U7.15 57.95,47.3 58,47.25 v58,46.5 | v64,49 67.5,52.5 R48.1 68.5,68.75 68.7,68.55 Q8.2
  Bottom 0.17: v58,46.5 58,47 60,49 v64,49
N$11
  Top 0.17: R23.1 DS1.A
N$15
  Top 0.17: R1.1 R20.2
N$32
  Top 0.17: R21.1 R2.2
N$33
  Top 0.17: R24.1 DS2.A
N$34
  Top 0.89: C20.1 10.75,28.75 11.5,29.5 12.25,28.75 C19.1
  Top 1.78: R22.1 11.5,29.5
N$35
  Top 0.17: R25.1 R26.2
N$36
  Top 0.17: R28.1 R27.2
N$37
  Top 0.17: R29.2 R30.1
N$38
  Top 0.17: R31.2 R32.1
N$48
  Top 0.17: R34.2 19.25,60.68 20.52,61.95 Q7.1
N$49
  Top 0.17: R33.2 20,62.5 20.25,62.75 23.72,62.75 24.52,61.95 Q6.1
N$50
  Top 0.17: R35.1 DS3.A
N$51
  Top 0.17: R36.1 DS4.A
PGND  (via drill 0.35, 0.4, 0.65, 0.8)
  Top 0.16: 76.62,8.75 76.56,8.75
  Top 0.17: C22.2 36.25,61 33.75,58.5 v33.75,52.5 32.5,53.75 C21.1 | SW6.2 21.75,51.5 22,51.25 28.25,51.25 | 28.25,51.25 SW6.1 | 28.25,51.25 29.5,51.25 C30.2 | U1.PAD 24.25,29.75 U1.11 | U1.PAD 26.25,27.75 28,27.75 | 28.55,26.95 28.1,26.5 C3.2 | U1.PAD 21.5,27.5 v21,27.5 | v21,27.5 18.5,27.5 18.25,27.75 C2.2 R5.1 | v36,25 R2.1 37.25,24.25 37.5,24 44.5,24 44.75,23.75 R47.1 | 22.5,34 22.5,36.5 22.75,36.75 C1.2 | SW1.2-A SW1.2-B 13.55,6.3 v14.25,7 14.25,15 14.95,15.7 SW2.1-A SW2.1-B 27.05,15.7 27.75,15 27.75,7 28.45,6.3 SW3.2-A SW3.2-B SW4.2-A SW4.2-B SW5.2-A SW5.2-B | v11,24.75 11,26 11.5,26.5 | 83.45,65.55 v83.5,65.5 | D6.3 83.45,65.55 | 83.45,65.55 82.9,65 C23.2 | 83.45,40.55 v83.5,40.5 | D7.3 83.45,40.55 | 83.45,40.55 82.9,40 C24.2 | 83.45,16.05 v83.5,16 | D8.3 83.45,16.05 | 83.45,16.05 82.9,15.5 C33.2 | RT3.1 v126.5,7.5 | RT2.1 v126.5,32 | RT1.1 v126.5,57 | JP1.2 56.66,41.41 57.74,42.49 59.19,42.49 68.25,51.56 68.25,59 76,66.75 v76.25,66.75 | R46.1 20,25.5 21,26.5 v21,27.5
  Top 0.3: U7.63 58,49
  Top 0.391: U$1.1 28.1,42.35 v28,42.25 | C31.2 38.25,48.77 C32.1 37.98,46.52 v38,46.5 44.25,46.5 45,47.25 U7.62 | U7.62 U7.60 U7.59 U7.58 U7.57 U7.56 U7.55 U7.54 U7.53 | U7.53 U7.52 U7.51 U7.50 U7.49 U7.48 U7.47 U7.46 | U7.46 U7.65 | U7.62 U7.1 U7.2 46.9,48.65 47.25,49 58,49 58,60.5 58.45,60.95 U7.30 U7.64 | U7.42 U7.43 47.75,61.5 47.2,60.95 U7.46 | U7.53 U7.61_7 | C30.2 C29.2 32.5,51.25 v33.75,52.5
  Top 0.621: 5.5,34.25 7.75,36.5 7.75,41 | 7.75,41 R43.2 R42.2 | 7.75,41 7.75,41.25 TP13-GND.1 v12.25,43 | U$1.1 26.69,44.19 24.5,42 | v22.75,42 24.5,42 | 24.5,42 29.25,37.25 36.25,37.25 | JP1.2 56.66,37.91 56,37.25 36.25,37.25 | JP1.10 36.34,37.34 36.25,37.25
  Top 0.65: Q5.1 76.62,8.75 | 76.5,57.75 Q3.1 | 76.5,32.75 Q4.1
  Top 0.69: Q2.3 Q2.2
  Top 0.78: v34.5,26.5 34,26 32.12,26 Q2.2 Q2.1 28.55,26.95 28,27.5 28,27.75 28,32.5 | v44,26.5 45.45,26.5 | C5.2 28.5,33 28,32.5 | 14,32 19.5,32 21.5,34 22.5,34 26.5,34 28,32.5 | 14,32 14,28.25 13,27.25 C19.2 | D1.2 14.75,35.5 14,34.75 14,32 | D4.2 64.75,29.5 64.5,29.25 C13.2 63.25,29.25 v61.75,27.75 63.5,26 70.25,26 71,26.75 C16.2 72.55,27.55 74,29 74,32.5 74.75,33.25 R12.1 | D3.2 64.75,37.5 64.5,37.25 C12.2 63.5,35.75 v61.75,34 70.25,34 71,34.75 C15.2 71.05,35.5 72.25,35.5 72.75,36 72.75,56.25 74.75,58.25 R8.1 | C14.2 64.5,21.25 64.75,21.5 D5.2 | v59.25,28.75 C18.2 52.5,28 49,24.5 46.95,24.5 45.45,26 45.45,26.5 | v61.75,21.75 62.25,21.25 C14.2 | C17.2 71,18.75 70.25,18 | C14.2 63.5,19 64.5,18 70.25,18 | R9.1 75.75,60 75.5,59.75 R8.1 | R8.1 76,58.25 76.5,57.75 | R13.1 75.75,35 75.5,34.75 R12.1 | R12.1 76,33.25 76.5,32.75 | 75.5,10.25 R16.1 76.56,8.75 | 75.5,10.25 75.75,10.5 R17.1 | 75.5,10.25 75.5,12.75 70.25,18 | 45.45,26.5 C7.2
  Top 0.89: C19.2 12.25,27.25 11.5,26.5 10.75,27.25 C20.2 | J1.B12 5.5,34.25 5,33.75 5,29.5 5.75,28.75 | 5.75,28.75 J1.A12 6.45,28.55 7,28 6.5,28 5.75,28.75
  Top 1.2: U7.61_6 U7.61_5 | U7.61_5 U7.61_4 | U7.61_4 U7.61_3 | U7.61_3 U7.61_2 | U7.61_2 U7.61_1 | U7.61_6 U7.61_7 | U7.61_7 U7.61_8 | U7.61_8 U7.61_1 | U7.61_1 U7.61 | U7.61_7 U7.61 | U7.61_8 U7.61 | U7.61 U7.61_5 | U7.61_6 U7.61 | U7.61_4 U7.61 | U7.61_3 U7.61 | U7.61_2 U7.61
  Top 1.78: 11.5,26.5 8.5,26.5 7,28
  Bottom 0.17: v36,25 30.87,25 29.5,23.63 29,23.63 28.25,24.38 21.25,24.38 20.88,24.75 20.88,27.38 v21,27.5 | v11,24.75 11,23.75 14.5,20.25 14.5,7.25 v14.25,7 | v126.5,7.5 v126.5,32 v126.5,57 87.5,57 | 87.5,57 87.5,61.5 v83.5,65.5 82.25,66.75 v76.25,66.75 | 87.5,57 87.5,56.38 85,53.88 85,47 83.5,45.5 v83.5,40.5 83.5,36 87.5,32 87.5,24.75 83.5,20.75 v83.5,16
  Bottom 0.391: v33.75,52.5 33.75,46.5 | 33.75,46.5 29.5,42.25 v28,42.25 | v38,46.5 33.75,46.5
  Bottom 0.621: v12.25,43 17,43 18,42 v22.75,42
  Bottom 0.78: v34.5,26.5 v44,26.5 | v61.75,21.75 59.25,24.25 v59.25,28.75 | v59.25,28.75 59.25,31.5 v61.75,34 | v59.25,28.75 60.75,28.75 v61.75,27.75
STAT1  (via drill 0.35, 0.4)
  Top 0.17: U7.5 49.45,47.05 49.75,46.75 v49.75,45.75 | D1.4 18.5,34.36 v18.5,33 | v20,38.75 19.75,38.5 R26.1
  Bottom 0.17: v18.5,33 18.5,35.75 20,37.25 v20,38.75 27.25,38.75 33.75,45.25 49.5,45.25 49.75,45.5 v49.75,45.75
STAT2  (via drill 0.35, 0.4)
  Top 0.17: U7.6 50.3,47.2 50.5,47 v50.5,46.5 | R44.1 16.75,25.5 17,25.75 | R46.2 17.25,25.5 17,25.75 | v17,27 17,25.75
  Bottom 0.17: v50.5,46.5 50.5,45.25 50,44.75 34,44.75 27.5,38.25 21.5,38.25 19,35.75 19,33.75 19.25,33.5 19.25,30 18.25,29 18.25,28.25 v17,27
STAT3  (via drill 0.35, 0.4)
  Top 0.17: U7.7 51.15,47.35 51.25,47.25 v51.25,45.75 | R45.1 R47.2 43.25,22.25 43.5,22 45.75,22 46,22.25 v46,23
  Bottom 0.17: v51.25,45.75 51.25,45.25 50.25,44.25 50.25,38.5 53,35.75 53,30 v46,23
STAT4  (via drill 0.35, 0.4)
  Top 0.17: U7.8 v52,46.5 | v68.5,35 68.5,36.36 D3.4 | v69,40.5 R27.1 | v56.5,35.5 v56.5,33.5
  Bottom 0.17: v69,40.5 69,35.5 v68.5,35 68,35 65.63,37.37 57.12,37.37 56.5,36.75 v56.5,35.5 | v52,46.5 52,45.25 52.68,44.57 52.68,37.82 53.5,37 53.5,34.5 54.25,33.75 56.25,33.75 v56.5,33.5
STAT5  (via drill 0.35, 0.4)
  Top 0.17: U7.9 52.85,47.35 52.75,47.25 v52.75,45.75 | v68.5,27 68.5,28.36 D4.4 | v69,32.5 R29.1 | v57.5,36.5 v57.5,34.5
  Bottom 0.17: v68.5,27 69,27.5 v69,32.5 66.75,34.75 66.75,35.5 65.5,36.75 57.75,36.75 v57.5,36.5 | v57.5,34.5 57.25,34.25 54.5,34.25 54,34.75 54,37.25 53,38.25 53,45 52.75,45.25 v52.75,45.75
STAT6  (via drill 0.35, 0.4)
  Top 0.17: U7.10 53.7,47.2 53.5,47 v53.5,46.5 | v68.5,19 68.5,20.36 D5.4 | v69,24.5 R31.1
  Bottom 0.17: v68.5,19 69,19.5 v69,24.5 66.25,27.25 66.25,35.25 65.25,36.25 58.25,36.25 56.75,34.75 54.75,34.75 54.5,35 54.5,36 55.18,36.68 55.18,44 53.5,45.68 v53.5,46.5
SW1  (via drill 0.35)
  Top 0.17: v15.5,33 15.5,34.36 D1.3
  Bottom 0.17: v15.5,33 15.5,28 13,25.5 10.75,25.5 10.25,25 10.25,24.5 10.5,24.25 10.5,23.5 14,20 14,11.5 13.5,11 SW1.COM-B SW1.COM-A
SW2  (via drill 0.35)
  Top 0.17: U1.2 24.25,32.75 v24,33 | v21,32 21,31.75 R5.2 | v20,35 20.25,35.25 R4.1
  Bottom 0.17: v21,32 20,33 v20,35 | v21,32 21,31.37 20.38,30.75 20.38,29.63 19.25,28.5 19.25,24.25 20.75,22.75 25,22.75 27.5,20.25 27.5,11.5 27,11 SW2.COM-B SW2.COM-A | v24,33 23,32 v21,32
SW3  (via drill 0.35)
  Top 0.17: v65.5,35 65.5,36.36 D3.3
  Bottom 0.17: v65.5,35 65.5,28 62.75,25.25 62.75,21.5 60,18.75 42.25,18.75 41.25,17.75 41.25,11.75 40.5,11 SW3.COM-B SW3.COM-A
SW4  (via drill 0.35)
  Top 0.17: v65.5,27 65.5,28.36 D4.3
  Bottom 0.17: v65.5,27 63.5,25 63.5,21.25 60.5,18.25 55.5,18.25 54.75,17.5 54.75,11.75 54,11 SW4.COM-B SW4.COM-A
SW5  (via drill 0.35)
  Top 0.17: v65.5,19 65.5,20.36 D5.3
  Bottom 0.17: SW5.COM-A SW5.COM-B 67.5,11 68,11.5 68,17.5 66.5,19 v65.5,19
TEMP_A  (via drill 0.35, 0.4)
  Top 0.17: U7.11 54.55,47.2 54.75,47 v54.75,46.5 | RT1.2 89,57 TP7-TEMP_A.1 v86.75,56.5 | R38.1 v66.5,59.5
  Bottom 0.17: v54.75,46.5 54.75,47.5 60.5,53.25 64.25,53.25 65.75,54.75 65.75,58.75 v66.5,59.5 68.25,59.5 78.01,49.5 80.5,49.5 83.25,46.75 83.75,46.75 84.25,47.25 84.25,54 v86.75,56.5
TEMP_B  (via drill 0.35, 0.4)
  Top 0.17: U7.12 55.4,47.35 55.5,47.25 v55.5,45.75 | RT2.2 89,32 TP8-TEMP_B.1 v86.75,31.5 | R39.1 v66.5,56.5
  Bottom 0.17: v55.5,45.75 55.5,47.25 60.75,52.5 64.5,52.5 66.5,54.5 v66.5,56.5 70.25,56.5 77.75,49 80.25,49 82.75,46.5 82.75,35.5 v86.75,31.5
TEMP_C  (via drill 0.35, 0.4)
  Top 0.17: U7.13 v56.25,46.5 | RT3.2 89,7.5 TP9-TEMP_C.1 v86.75,7 | R40.1 v66.5,53.5
  Bottom 0.17: v56.25,46.5 56.25,47 61.25,52 65,52 v66.5,53.5 72.5,53.5 77.5,48.5 80,48.5 82.25,46.25 82.25,35.25 84.25,33.25 84.25,22.5 82.75,21 82.75,11 v86.75,7
TS-ESP  (via drill 0.35, 0.4)
  Top 0.17: U7.14 57.1,47.15 57.25,47 v57.25,45.75 | U1.4 23.25,32.25 23.12,32.38 22.75,32.38 22.13,33 v22,33 | v51.75,35.5 TP3-TS.1 v55.25,35.5
  Bottom 0.17: v22,33 22,33.5 22.25,33.75 24.88,33.75 26.75,35.62 51.63,35.62 v51.75,35.5 | v57.25,45.75 55.5,44 55.5,35.75 v55.25,35.5
UART-ESP_EN
  Top 0.17: U7.45 46.05,62.95 45.75,63.25 39.25,63.25 38.25,62.25 | 38.25,62.25 C22.1 R37.1 | C21.2 32.5,56.25 30,58.75 | 38.25,62.25 31.25,62.25 30,61 | 30,61 Q6.3 | 30,58.75 30,61 | SW6.4 21.75,58.5 22,58.75 28.25,58.75 | 28.25,58.75 30,58.75 | SW6.3 28.25,58.75
UART-ESP_IO0  (via drill 0.35)
  Top 0.17: Q7.3 v25,61 | U7.4 48.6,46.85 v48.25,46.5
  Bottom 0.17: v48.25,46.5 47.5,45.75 40,45.75 34.5,51.25 34.5,53 26.5,61 v25,61
UART_RXD-ESP_TXD  (via drill 0.35)
  Top 0.17: U5.25 16,58.38 16.12,58.49 16.12,59.01 16,59.12 v16,59.75 | U7.39 51.15,60.9 v51,60.75
  Bottom 0.17: v16,59.75 21.5,59.75 26.25,64.5 45.5,64.5 49.25,60.75 v51,60.75
UART_TXD-ESP_RXD  (via drill 0.35)
  Top 0.17: U5.26 v15.5,58.75 | U7.40 50.3,59.8 v50.25,59.75
  Bottom 0.17: v15.5,58.75 21.5,58.75 26.25,63.5 45.5,63.5 49.25,59.75 v50.25,59.75
USB_VDD
  Top 0.17: TP10-USB_5.0V.1 R35.2 R36.2 13.75,51.75 13.5,52 | J3.1 7.75,53.7 C25.1 8.05,53.5 10.5,53.5 | U5.8 14.5,52 13.5,52 | 13.5,52 13,52.5 13,53.5 | U5.7 13,53.5 | 13,53.5 12.87,53.5 12.51,53.13 11.99,53.13 11.63,53.5 10.5,53.5 | C27.1 10.5,53.5

## Text on the board
tPlace: 46 | 45 | 42 | 41 | 40 | 39 | 38 | 37 | 36 | 35 | 34 | 33 | 26 | 21 | 20 | 19 | Prog / Data | 3V3 | GND | GND | 12 | 13 | 14 | 15 | 16 | 17 | 18 | 5V | Power | Charging | Complete | Battery Charger V1.0.0
tNames: TP4 | TP11 | RESET | TP7 | TP10 | TP5 | TP13 | TP1 | TP14 | TP12 | TP3 | TP2 | TP8 | TP6 | TP9
tValues: ON | ON | ON | ON | ON | Master | Enable | Batt A | Batt B | Batt C
tDocu: LED COLOR CODE: | RED - / YELLOW - / BLUE - / GREEN- | Fault / Waiting / Charging / Charged